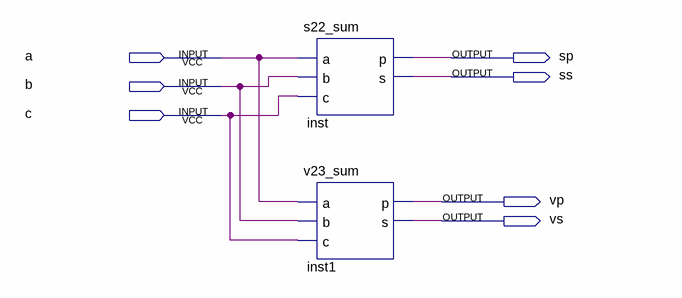
[diagram p0: schematic sheet]
// Quartus schematic sv23_sum.bdf as structural Verilog: 2 symbols, 7 pins
module sv23_sum (
  input  a,
  input  b,
  input  c,
  output sp,
  output ss,
  output vp,
  output vs
);

  s22_sum inst (.a(a), .b(b), .c(c), .p(sp), .s(ss));
  v23_sum inst1 (.a(a), .b(b), .c(c), .p(vp), .s(vs));
endmodule
